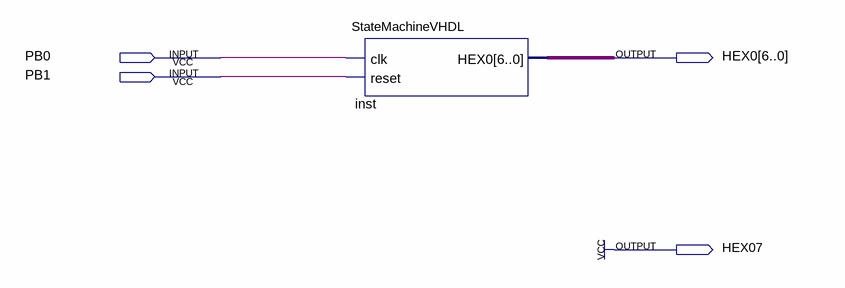
[diagram p0: schematic sheet]
// Quartus schematic lab5VHDL.bdf as structural Verilog: 1 symbols, 4 pins
module lab5VHDL (
  input  PB0,
  input  PB1,
  output [6:0] HEX0,
  output HEX07
);

  StateMachineVHDL inst (.clk(PB0), .reset(PB1), .HEX0(HEX0));

  assign HEX07 = 1'b1;
endmodule
